# Altium schematic sheet Ethernet Shield v2.0.SchDoc
size 363 x 433 mm; Origin: Eagle
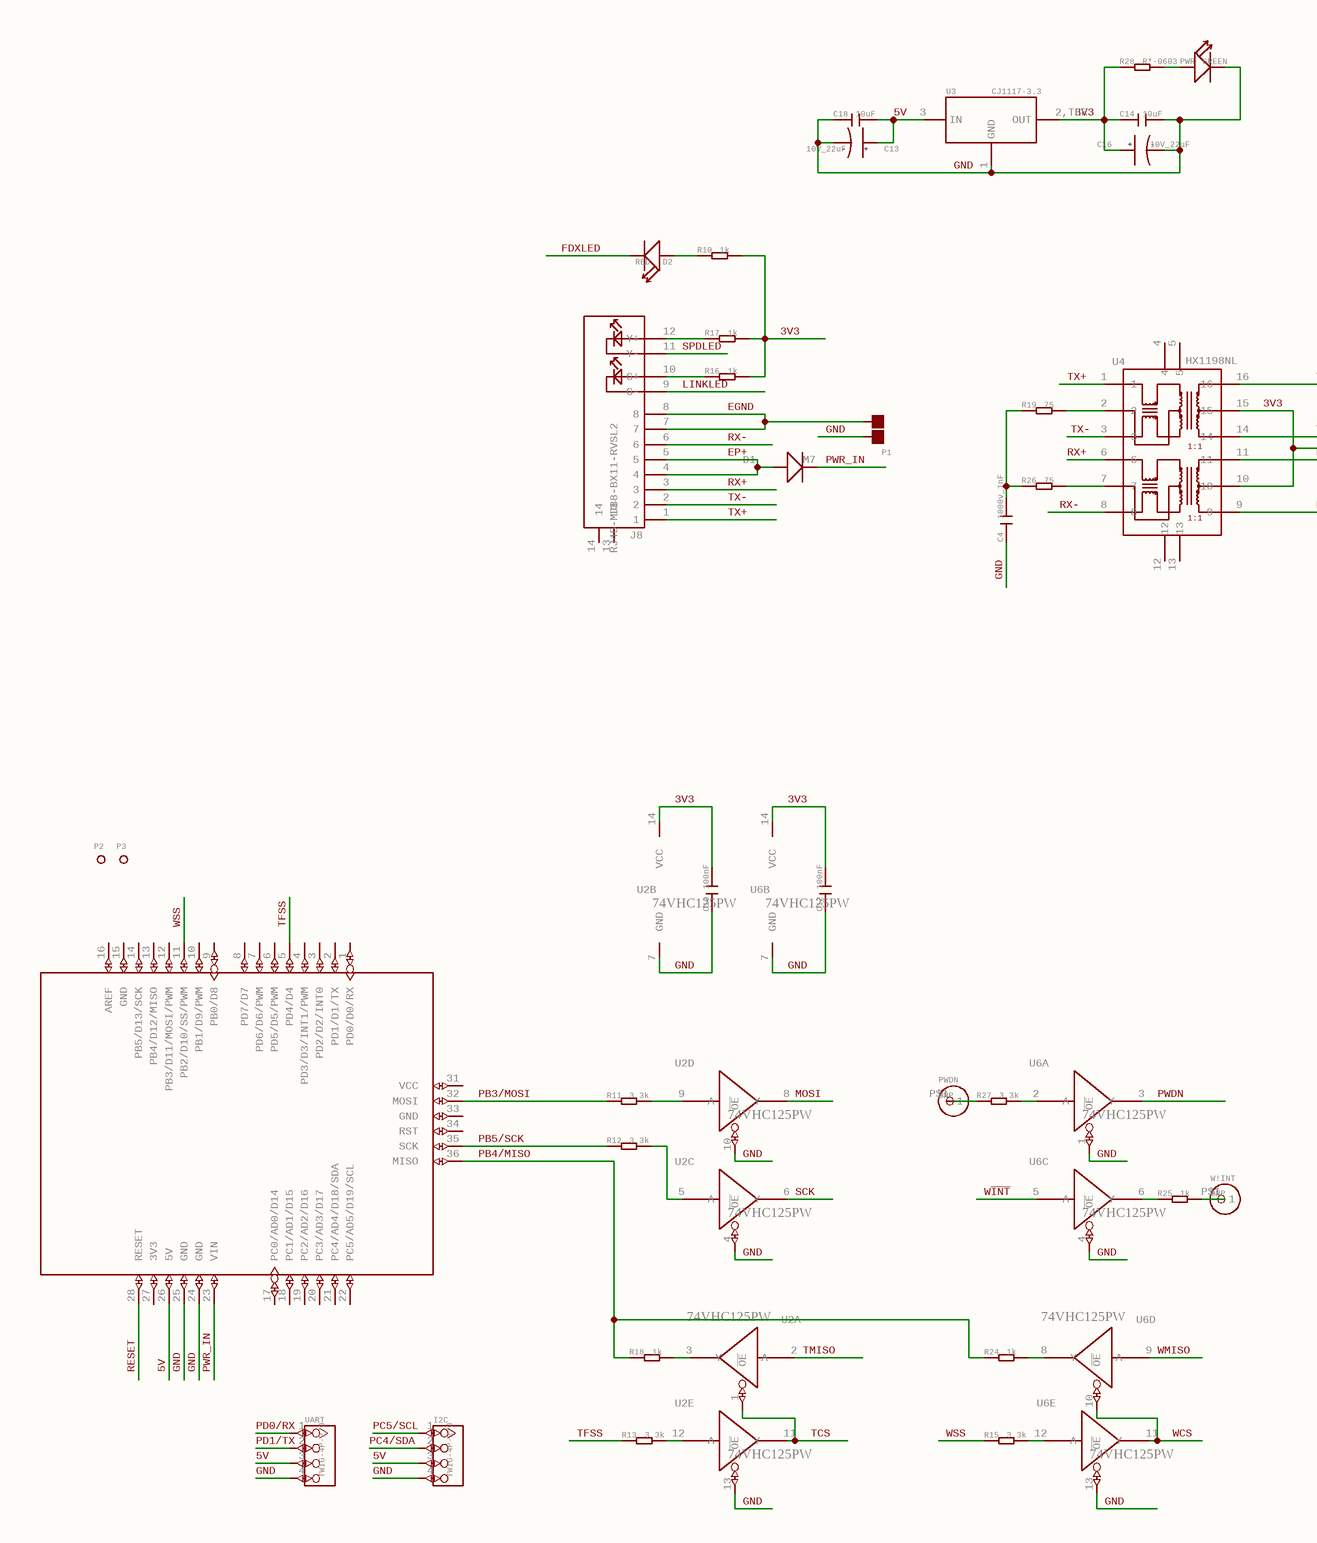
[diagram p0: Ethernet Shield v2.0.SchDoc, top left]
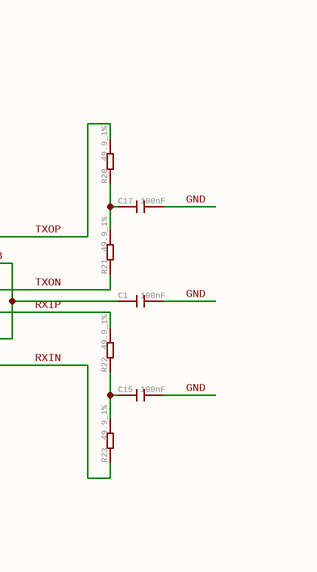
[diagram p1: Ethernet Shield v2.0.SchDoc, top right]
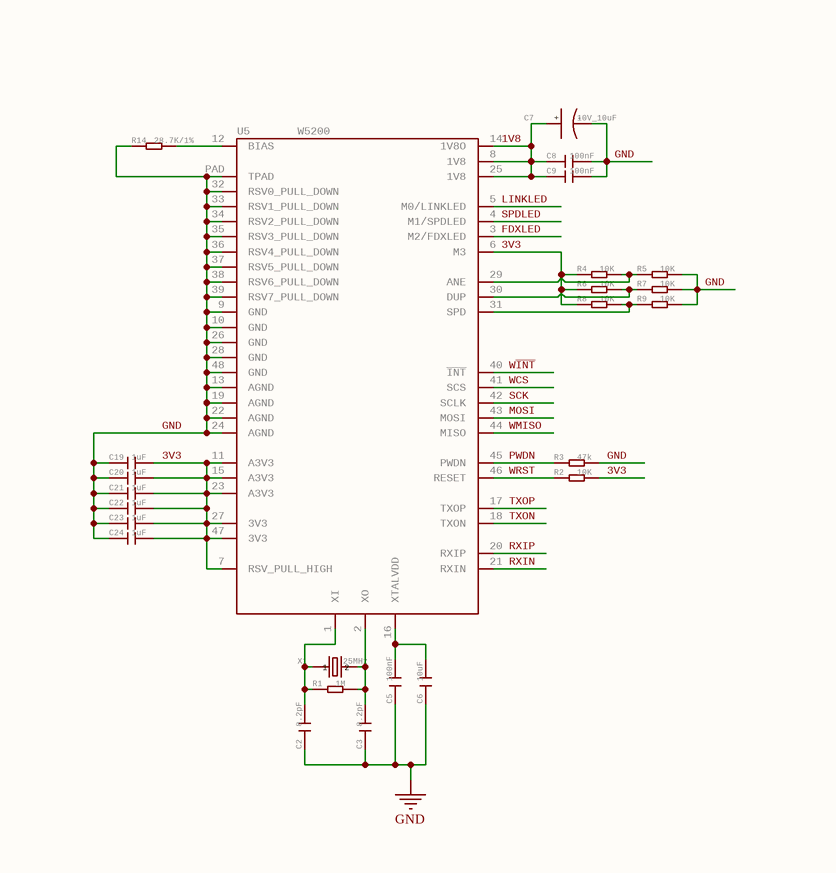
[diagram p2: Ethernet Shield v2.0.SchDoc, bottom left]
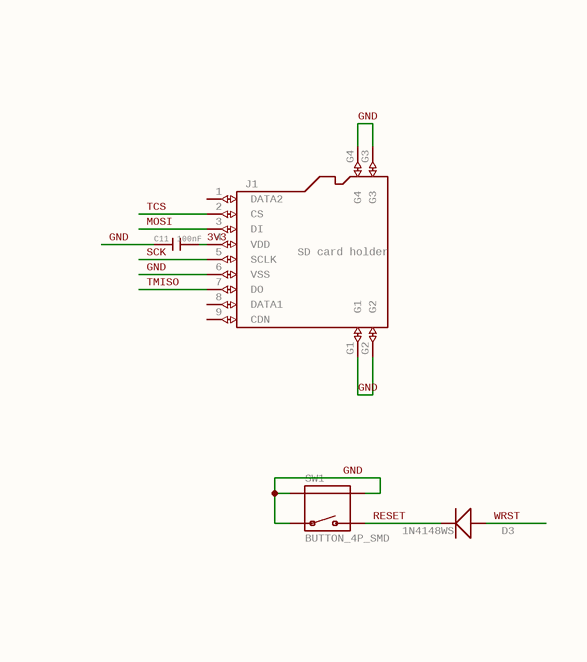
[diagram p3: Ethernet Shield v2.0.SchDoc, bottom right]

## Parts
C1  100nF  [C0603]
C2  8.2pF  [C0603]
C3  8.2pF  [C0603]
C4  1000v_1nF  [C1206]
C5  100nF  [C0603]
C6  10uF  [C0805]
C7  10V_10uF  [AVX-A]
C8  100nF  [C0603]
C9  100nF  [C0603]
C10  100nF  [C0603]
C11  100nF  [C0603]
C12  100nF  [C0603]
C13  10V_22uF  [AVX-B]
C14  10uF  [C0805]
C15  100nF  [C0603]
C16  10V_22uF  [AVX-B]
C17  100nF  [C0603]
C18  10uF  [C0805]
C19  1uF  [C0805]
C20  1uF  [C0805]
C21  1uF  [C0805]
C22  1uF  [C0805]
C23  1uF  [C0805]
C24  1uF  [C0805]
D1  M7  [D2010]
D2  RED  [LED-0603]
D3  1N4148WS  [SOD323]
I2C  TWIG-4P-2.0  [4P-2.0]
J1  SD card holder  [9P-SMD-W/-RING]
J8  RJ45-MJ88-BX11-RVSL2  [RJ45-MJ88-BX11-RVSL2]
P1  DNP  [2P-SMD-1.78X1.27]  (value not drawn)
P2  PAD-MARK  [ROUND-MARK-1.0]  (value not drawn)
P3  PAD-MARK  [ROUND-MARK-1.0]  (value not drawn)
PWDN  DNP  [1P-65/35MIL]
PWR  GREEN  [LED-0603]
R1  1M  [R0603]
R2  10K  [R0603]
R3  47k  [R0603]
R4  10K  [R0603]
R5  10K  [R0603]
R6  10K  [R0603]
R7  10K  [R0603]
R8  10K  [R0603]
R9  10K  [R0603]
R10  1k  [R0603]
R11  3.3k  [R0603]
R12  3.3k  [R0603]
R13  3.3k  [R0603]
R14  28.7K/1%  [R0603]
R15  3.3k  [R0603]
R16  1k  [R0603]
R17  1k  [R0603]
R18  1k  [R0603]
R19  75  [R0603]
R20  49.9_1%  [R0603]
R21  49.9_1%  [R0603]
R22  49.9_1%  [R0603]
R23  49.9_1%  [R0603]
R24  1k  [R0603]
R25  1k  [R0603]
R26  75  [R0603]
R27  3.3k  [R0603]
R28  R*-0603  [R0603]
SW1  BUTTON_4P_SMD  [4P-SMD-7X3.5X3.5]
U1  ARDUINO  [ARDUINO]  (value not drawn)
U2  74VHC125PW  [TSSOP14]  (parts A,B,C,D,E of 5)
U3  CJ1117-3.3  [SOT-223]
U4  HX1198NL  [SOIC16-9.53]
U5  W5200  [QFN48]
U6  74VHC125PW  [TSSOP14]  (parts A,B,C,D,E of 5)
UART  TWIG-4P-2.0  [4P-2.0]
W!INT  DNP  [1P-65/35MIL]
X1  25MHz  [2P-SMD-5X3.2]

## Nets
GND: C1.2 C2.1 C3.1 C4.1 C5.1 C6.1 C7.- C8.2 C9.2 C10.1 C11.1 C12.1 C13.- C14.2 C15.2 C16.- C17.2 C18.1 C19.1 C20.1 C21.1 C22.1 C23.1 C24.1 I2C.4 J1.6(VSS) J1.G1 J1.G2 J1.G3 J1.G4 P1.2 PWR.- R3.2 R5.2 R7.2 R9.2 R14.1 SW1.1 SW1.S1 SW1.S2 U1.24(GND) U1.25(GND) U2.4(~{OE}) U2.7(GND) U2.10(~{OE}) U2.13(~{OE}) U3.1(GND) U5.9(GND) U5.10(GND) U5.13(AGND) U5.19(AGND) U5.22(AGND) U5.24(AGND) U5.26(GND) U5.28(GND) U5.32(RSV0_PULL_DOWN) U5.33(RSV1_PULL_DOWN) U5.34(RSV2_PULL_DOWN) U5.35(RSV3_PULL_DOWN) U5.36(RSV4_PULL_DOWN) U5.37(RSV5_PULL_DOWN) U5.38(RSV6_PULL_DOWN) U5.39(RSV7_PULL_DOWN) U5.48(GND) U5.PAD(TPAD) U6.1(~{OE}) U6.4(~{OE}) U6.7(GND) U6.13(~{OE}) UART.4
1V8: C7.+ C8.1 C9.1 U5.8(1V8) U5.14(1V8O) U5.25(1V8)
3V3: C1.1 C10.2 C11.2 C12.2 C14.1 C16.+ C19.2 C20.2 C21.2 C22.2 C23.2 C24.2 J1.4(VDD) R2.2 R4.1 R4.2 R5.1 R6.1 R6.2 R7.1 R8.1 R10.2 R16.2 R17.2 R28.1 U2.14(VCC) U3.2,TER(OUT) U4.10 U4.15 U5.6(M3) U5.7(RSV_PULL_HIGH) U5.11(A3V3) U5.15(A3V3) U5.23(A3V3) U5.27(3V3) U5.29(ANE) U5.30(DUP) U5.47(3V3) U6.14(VCC)
5V: C13.+ C18.2 I2C.3 U1.26(5V) U3.3(IN) UART.3
EGND: J8.7 J8.8 P1.1
EP+: D1.+ J8.4 J8.5
FDXLED: D2.- U5.3(M2/FDXLED)
LINKLED: J8.9(G-) U5.5(M0/LINKLED)
MOSI: J1.3(DI) U2.8(Y) U5.43(MOSI)
PB3/MOSI: R11.1 U1.32(MOSI)
PB4/MISO: R18.1 R24.1 U1.36(MISO)
PB5/SCK: R12.1 U1.35(SCK)
PC4/SDA: I2C.2
PC5/SCL: I2C.1
PD0/RX: UART.1
PD1/TX: UART.2
PWDN: R3.1 U5.45(PWDN) U6.3(Y)
PWR_IN: D1.- U1.23(VIN)
RESET: D3.- SW1.2 U1.28(RESET)
RX+: J8.3 U4.6
RX-: J8.6 U4.8
RXIN: R23.1 U4.9 U5.21(RXIN)
RXIP: R22.2 U4.11 U5.20(RXIP)
SCK: J1.5(SCLK) U2.6(Y) U5.42(SCLK)
SPDLED: J8.11(Y-) U5.4(M1/SPDLED)
TCS: J1.2(CS) U2.1(~{OE}) U2.11(Y)
TFSS: R13.1 U1.5(PD4/D4)
TMISO: J1.7(DO) U2.2(A)
TX+: J8.1 U4.1
TX-: J8.2 U4.3
TXON: R21.1 U4.14 U5.18(TXON)
TXOP: R20.2 U4.16 U5.17(TXOP)
WCS: U5.41(SCS) U6.10(~{OE}) U6.11(Y)
W~{INT}: U5.40(~{INT}) U6.5(A)
WMISO: U5.44(MISO) U6.9(A)
WRST: D3.+ R2.1 U5.46(RESET)
WSS: R15.1 U1.11(PB2/D10/SS/PWM)
NetC2_2: C2.2 R1.1 U5.1(XI) X1.1
NetC3_2: C3.2 R1.2 U5.2(XO) X1.2
NetC4_2: C4.2 R19.1 R26.1
NetC5_2: C5.2 C6.2 U5.16(XTALVDD)
NetC15_1: C15.1 R22.1 R23.2
NetC17_1: C17.1 R20.1 R21.2
NetD2_+: D2.+ R10.1
NetJ8_10: J8.10(G+) R16.1
NetJ8_12: J8.12(Y+) R17.1
NetPWDN_P$1: PWDN.P$1(1) R27.1
NetPWR_+: PWR.+ R28.2
NetR8_2: R8.2 R9.1 U5.31(SPD)
NetR11_2: R11.2 U2.9(A)
NetR12_2: R12.2 U2.5(A)
NetR13_2: R13.2 U2.12(A)
NetR14_2: R14.2 U5.12(BIAS)
NetR15_2: R15.2 U6.12(A)
NetR18_2: R18.2 U2.3(Y)
NetR19_2: R19.2 U4.2
NetR24_2: R24.2 U6.8(Y)
NetR25_1: R25.1 U6.6(Y)
NetR25_2: R25.2 W!INT.P$1(1)
NetR26_2: R26.2 U4.7
NetR27_2: R27.2 U6.2(A)

Not connected (* = marked no-connect by the designer): J1 1(DATA2) 8(DATA1) 9(CDN); J8 13 14; U1 1(PD0/D0/RX) 2(PD1/D1/TX) 3(PD2/D2/INT0) 4(PD3/D3/INT1/PWM) 6(PD5/D5/PWM) 7(PD6/D6/PWM) 8(PD7/D7) 9(PB0/D8) 10(PB1/D9/PWM) 12(PB3/D11/MOSI/PWM) 13(PB4/D12/MISO) 14(PB5/D13/SCK) 15(GND) 16(AREF) 17(PC0/AD0/D14) 18(PC1/AD1/D15) 19(PC2/AD2/D16) 20(PC3/AD3/D17) 21(PC4/AD4/D18/SDA) 22(PC5/AD5/D19/SCL) 27(3V3) 31(VCC) 33(GND) 34(RST); U4 4 5 12 13

## Library data of the parts
C1-C3 C5 C8-C12 C15 C17 = C*-0603: Ceramic Capacitors; GateName_1: C; DeviceName: -0603; DeviceSetName: C*; SymbolName_1: C; LibraryName: Discrete
C4 = C*-1206: Ceramic Capacitors; GateName_1: C; DeviceName: -1206; DeviceSetName: C*; SymbolName_1: C; LibraryName: Discrete
C6 C14 C18-C24 = C*-0805: Ceramic Capacitors; GateName_1: C; DeviceName: -0805; DeviceSetName: C*; SymbolName_1: C; LibraryName: Discrete
C7 = CAP*-AVX-A: Electrolytic Capacitors,Tantalum Capacitors and Super Capacitors; GateName_1: C; DeviceName: -AVX-A; DeviceSetName: CAP*; SymbolName_1: CAPACITOR; LibraryName: Discrete; +: +; -: -
C13 C16 = CAP*-AVX-B: Electrolytic Capacitors,Tantalum Capacitors and Super Capacitors; GateName_1: C; DeviceName: -AVX-B; DeviceSetName: CAP*; SymbolName_1: CAPACITOR; LibraryName: Discrete; +: +; -: -
D1 = D*'SMA': GateName_1: D; SymbolName_1: DIODE; DeviceName: 'SMA'; DeviceSetName: D*; LibraryName: Discrete
D2 PWR = LED*'0603': GateName_1: LED; DeviceName: '0603'; DeviceSetName: LED*; SymbolName_1: LED; LibraryName: Discrete
D3 = D*'0805': GateName_1: D; SymbolName_1: DIODE; DeviceName: '0805'; DeviceSetName: D*; LibraryName: Discrete
I2C UART = TWIG-4P-2.0-2.0: GateName_1: G$1; SymbolName_1: TWIG_2.0; DeviceName: -2.0; LibraryName: Connector; DeviceSetName: TWIG-4P-2.0
J1 = HOLDER-MICROSD-9P: GateName_1: G$1; SymbolName_1: MICROSD; LibraryName: Connector; DeviceSetName: HOLDER-MICROSD-9P
J8 = RJ45-MJ88-BX11-RVSL2: Modular Jack 8P8C,R/A,With LED; GateName_1: RJ; SymbolName_1: RJ45-MJ88-BX11-RVSL2; LibraryName: Connector; DeviceSetName: RJ45-MJ88-BX11-RVSL2
P1 = PAD-JUMPER-2P: GateName_1: G$1; SymbolName_1: JP_SW-1; LibraryName: Discrete; DeviceSetName: PAD-JUMPER-2P; PARTNO: DNP
P2 P3 = PAD-MARK: PARTNO: DNP; GateName_1: G$1; SymbolName_1: MARK; LibraryName: Discrete; DeviceSetName: PAD-MARK
PWDN W!INT = HEADER-1P-35: GateName_1: G$1; SymbolName_1: CK_1X1; DeviceName: -35; LibraryName: Connector; DeviceSetName: HEADER-1P
R1-R28 = R*-0603: GateName_1: R; DeviceName: -0603; DeviceSetName: R*; SymbolName_1: R; LibraryName: Discrete
SW1 = BUTTON_4P_SMD: TS-1188E  http://www.best-dz.com/?thread-374-2.html; GateName_1: SW; SymbolName_1: BUTTON-4P-SMD; LibraryName: For_Test_Albert_v6; DeviceSetName: BUTTON_4P_SMD
U2 U6 = 74V*125PW: Quad Buffer/Line Driver;3-state; GateName_1: A; SymbolName_1: BUFFER; GateName_2: PWR; SymbolName_2: VCC-GND; GateName_3: B; GateName_4: C; GateName_5: D; DeviceName: PW; SymbolName_3: BUFFER; SymbolName_4: BUFFER; SymbolName_5: BUFFER; LibraryName: IC; DeviceSetName: 74V*125
U3 = LD1117S: Low Drop Fixed And Adjustable Positive Voltage Regulators http://www.datasheetcatalog.org/datasheet/SGSThomsonMicroelectronics/mXuqtqv.pdf; GateName_1: G$1; SymbolName_1: LD1117DT; DeviceName: S; DeviceSetName: LD1117; LibraryName: IC
U4 = HX1198NL: 10/100BASE-T Single Port Surface Mount Magnetics With Various Turns Ratios; GateName_1: G$1; SymbolName_1: HX1198NL; LibraryName: IC; DeviceSetName: HX1198NL; 1:1: 1:1
U5 = W5200: GateName_1: G$1; SymbolName_1: W5200; LibraryName: For_Test_Albert_v6; DeviceSetName: W5200
X1 = CRYSTAL*'5032': CRYSTAL; GateName_1: X; SymbolName_1: Q; DeviceName: '5032'; LibraryName: Discrete; DeviceSetName: CRYSTAL*; 1: 1; 2: 2
U1 = ARDUINO: GateName_1: ARDUINO; SymbolName_1: ARDUINO; LibraryName: moudle; DeviceSetName: ARDUINO